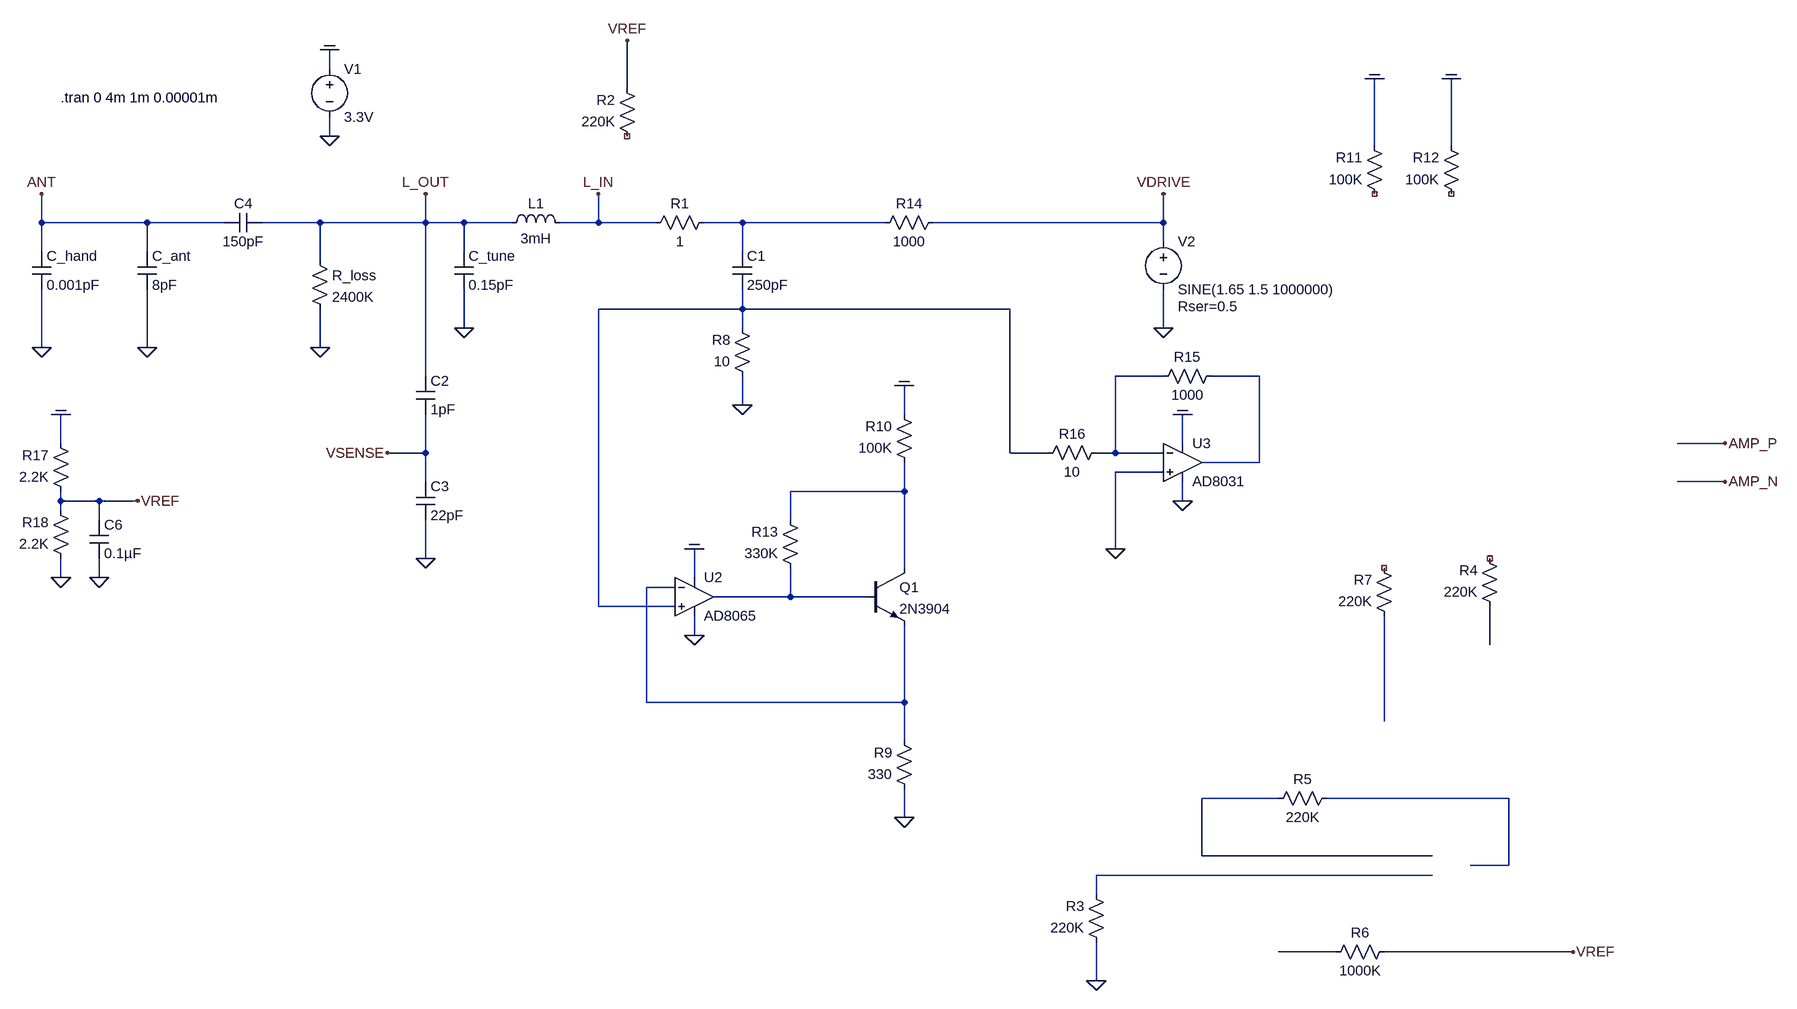
[diagram p0: schematic 2020_oscillator_experiments_v4.asc]
2020_oscillator_experiments_v4.asc, the LTspice schematic file:
Version 4
SHEET 1 3244 1620
WIRE 0 80 0 48
WIRE 496 112 496 32
WIRE 0 192 0 160
WIRE 1792 208 1792 96
WIRE 1920 208 1920 96
WIRE -480 336 -480 288
WIRE -304 336 -480 336
WIRE -176 336 -304 336
WIRE -16 336 -112 336
WIRE 160 336 160 288
WIRE 160 336 -16 336
WIRE 224 336 160 336
WIRE 304 336 224 336
WIRE 448 336 448 288
WIRE 448 336 384 336
WIRE 544 336 448 336
WIRE 688 336 624 336
WIRE 976 336 688 336
WIRE 1440 336 1440 288
WIRE 1440 336 1056 336
WIRE 1440 368 1440 336
WIRE -480 384 -480 336
WIRE -304 384 -304 336
WIRE 224 384 224 336
WIRE 688 384 688 336
WIRE -16 400 -16 336
WIRE 688 480 688 448
WIRE 688 480 448 480
WIRE 1184 480 688 480
WIRE 224 512 224 448
WIRE 688 512 688 480
WIRE 1440 512 1440 448
WIRE -480 544 -480 448
WIRE -304 544 -304 448
WIRE -16 544 -16 480
WIRE 160 592 160 336
WIRE 1440 592 1360 592
WIRE 1600 592 1520 592
WIRE 688 640 688 592
WIRE 1008 656 1008 608
WIRE -448 704 -448 656
WIRE 1472 704 1472 656
WIRE 2688 704 2608 704
WIRE 160 720 160 656
WIRE 160 720 96 720
WIRE 1184 720 1184 480
WIRE 1248 720 1184 720
WIRE 1360 720 1360 592
WIRE 1360 720 1328 720
WIRE 1440 720 1360 720
WIRE 1600 736 1600 592
WIRE 1600 736 1504 736
WIRE 1440 752 1360 752
WIRE 160 768 160 720
WIRE 2688 768 2608 768
WIRE 1008 784 1008 736
WIRE 1008 784 768 784
WIRE -448 800 -448 784
WIRE -384 800 -448 800
WIRE -320 800 -384 800
WIRE 1472 800 1472 768
WIRE -448 816 -448 800
WIRE -384 832 -384 800
WIRE 768 832 768 784
WIRE 1360 880 1360 752
WIRE 160 896 160 832
WIRE 1008 912 1008 784
WIRE -448 928 -448 896
WIRE -384 928 -384 896
WIRE 608 928 608 880
WIRE 576 944 528 944
WIRE 768 960 768 912
WIRE 768 960 640 960
WIRE 944 960 768 960
WIRE 448 976 448 480
WIRE 576 976 448 976
WIRE 608 1024 608 992
WIRE 1984 1040 1984 976
WIRE 528 1136 528 944
WIRE 1008 1136 1008 1008
WIRE 1008 1136 528 1136
WIRE 1808 1168 1808 992
WIRE 1008 1200 1008 1136
WIRE 1632 1296 1504 1296
WIRE 2016 1296 1712 1296
WIRE 1008 1328 1008 1280
WIRE 1504 1392 1504 1296
WIRE 1888 1392 1504 1392
WIRE 2016 1408 2016 1296
WIRE 2016 1408 1952 1408
WIRE 1888 1424 1328 1424
WIRE 1328 1456 1328 1424
WIRE 1728 1552 1632 1552
WIRE 2176 1552 1808 1552
WIRE 1328 1600 1328 1536
FLAG 0 192 0
FLAG 0 48 COM
FLAG -480 288 ANT
FLAG -480 544 0
FLAG -304 544 0
FLAG 688 640 0
FLAG 160 896 0
FLAG -16 544 0
FLAG 1440 512 0
FLAG 1440 288 VDRIVE
FLAG 96 720 VSENSE
FLAG 448 288 L_IN
FLAG 160 288 L_OUT
FLAG 224 512 0
FLAG 2688 704 AMP_P
FLAG 2688 768 AMP_N
FLAG 1792 96 COM
FLAG 1920 96 COM
FLAG -448 928 0
FLAG -448 656 COM
FLAG -384 928 0
FLAG -320 800 VREF
FLAG 608 880 COM
FLAG 608 1024 0
FLAG 2176 1552 VREF
FLAG 496 32 VREF
FLAG 1328 1600 0
FLAG 1008 1328 0
FLAG 1008 608 COM
FLAG 1472 656 COM
FLAG 1472 800 0
FLAG 1360 880 0
SYMBOL voltage 0 64 R0
WINDOW 123 0 0 Left 0
WINDOW 39 0 0 Left 0
SYMATTR InstName V1
SYMATTR Value 3.3V
SYMBOL ind 288 352 R270
WINDOW 0 32 56 VTop 2
WINDOW 3 5 56 VBottom 2
SYMATTR InstName L1
SYMATTR Value 3mH
SYMATTR SpiceLine Rser=120 Rpar=20Meg
SYMBOL cap 672 384 R0
SYMATTR InstName C1
SYMATTR Value 250pF
SYMBOL cap 144 592 R0
SYMATTR InstName C2
SYMATTR Value 1pF
SYMBOL cap 144 768 R0
SYMATTR InstName C3
SYMATTR Value 22pF
SYMBOL cap -320 384 R0
SYMATTR InstName C_ant
SYMATTR Value 8pF
SYMBOL cap -496 384 R0
SYMATTR InstName C_hand
SYMATTR Value 0.001pF
SYMBOL cap -112 320 R90
WINDOW 0 0 32 VBottom 2
WINDOW 3 32 32 VTop 2
SYMATTR InstName C4
SYMATTR Value 150pF
SYMBOL res -32 384 R0
SYMATTR InstName R_loss
SYMATTR Value 2400K
SYMBOL voltage 1440 352 R0
WINDOW 123 0 0 Left 0
WINDOW 39 24 124 Left 2
SYMATTR SpiceLine Rser=0.5
SYMATTR InstName V2
SYMATTR Value SINE(1.65 1.5 1000000)
SYMBOL res 640 320 R90
WINDOW 0 0 56 VBottom 2
WINDOW 3 32 56 VTop 2
SYMATTR InstName R1
SYMATTR Value 1
SYMBOL res 512 208 R180
WINDOW 0 36 76 Left 2
WINDOW 3 36 40 Left 2
SYMATTR InstName R2
SYMATTR Value 220K
SYMBOL res 1344 1552 R180
WINDOW 0 36 76 Left 2
WINDOW 3 36 40 Left 2
SYMATTR InstName R3
SYMATTR Value 220K
SYMBOL cap 208 384 R0
SYMATTR InstName C_tune
SYMATTR Value 0.15pF
SYMBOL res 1808 304 R180
WINDOW 0 36 76 Left 2
WINDOW 3 36 40 Left 2
SYMATTR InstName R11
SYMATTR Value 100K
SYMBOL res 1936 304 R180
WINDOW 0 36 76 Left 2
WINDOW 3 36 40 Left 2
SYMATTR InstName R12
SYMATTR Value 100K
SYMBOL res -432 800 R180
WINDOW 0 36 76 Left 2
WINDOW 3 36 40 Left 2
SYMATTR InstName R17
SYMATTR Value 2.2K
SYMBOL res -432 912 R180
WINDOW 0 36 76 Left 2
WINDOW 3 36 40 Left 2
SYMATTR InstName R18
SYMATTR Value 2.2K
SYMBOL cap -400 832 R0
SYMATTR InstName C6
SYMATTR Value 0.1µF
SYMBOL res 1712 1568 R270
WINDOW 0 32 56 VTop 2
WINDOW 3 0 56 VBottom 2
SYMATTR InstName R6
SYMATTR Value 1000K
SYMBOL Opamps\\AD8065 608 896 R0
SYMATTR InstName U2
SYMBOL res 2000 992 R180
WINDOW 0 36 76 Left 2
WINDOW 3 36 40 Left 2
SYMATTR InstName R4
SYMATTR Value 220K
SYMBOL res 1616 1312 R270
WINDOW 0 32 56 VTop 2
WINDOW 3 0 56 VBottom 2
SYMATTR InstName R5
SYMATTR Value 220K
SYMBOL res 1824 1008 R180
WINDOW 0 36 76 Left 2
WINDOW 3 36 40 Left 2
SYMATTR InstName R7
SYMATTR Value 220K
SYMBOL res 704 608 R180
WINDOW 0 36 76 Left 2
WINDOW 3 36 40 Left 2
SYMATTR InstName R8
SYMATTR Value 10
SYMBOL res 1024 1296 R180
WINDOW 0 36 76 Left 2
WINDOW 3 36 40 Left 2
SYMATTR InstName R9
SYMATTR Value 330
SYMBOL npn 944 912 R0
SYMATTR InstName Q1
SYMATTR Value 2N3904
SYMBOL res 1024 752 R180
WINDOW 0 36 76 Left 2
WINDOW 3 36 40 Left 2
SYMATTR InstName R10
SYMATTR Value 100K
SYMBOL res 784 928 R180
WINDOW 0 36 76 Left 2
WINDOW 3 36 40 Left 2
SYMATTR InstName R13
SYMATTR Value 330K
SYMBOL res 1072 320 R90
WINDOW 0 0 56 VBottom 2
WINDOW 3 32 56 VTop 2
SYMATTR InstName R14
SYMATTR Value 1000
SYMBOL res 1424 608 R270
WINDOW 0 32 56 VTop 2
WINDOW 3 0 56 VBottom 2
SYMATTR InstName R15
SYMATTR Value 1000
SYMBOL res 1232 736 R270
WINDOW 0 32 56 VTop 2
WINDOW 3 0 56 VBottom 2
SYMATTR InstName R16
SYMATTR Value 10
SYMBOL Opamps\\AD8031 1472 672 R0
SYMATTR InstName U3
TEXT -448 128 Left 2 !.tran 0 4m 1m 0.00001m

The netlist it stands for:
* 2020_oscillator_experiments_v4.asc
V1 COM 0 3.3V
L1 L_OUT L_IN 3mH Rser=120 Rpar=20Meg
C1 N001 N002 250pF
C2 L_OUT VSENSE 1pF
C3 VSENSE 0 22pF
C_ant ANT 0 8pF
C_hand ANT 0 0.001pF
C4 L_OUT ANT 150pF
R_loss L_OUT 0 2400K
V2 VDRIVE 0 SINE(1.65 1.5 1000000) Rser=0.5
R1 N001 L_IN 1
R2 NC_01 VREF 220K
R3 0 N012 220K
C_tune L_OUT 0 0.15pF
R11 NC_02 COM 100K
R12 NC_03 COM 100K
R17 VREF COM 2.2K
R18 0 VREF 2.2K
C6 VREF 0 0.1µF
R6 N013 VREF 1000K
XU2 N002 N006 COM 0 N007 AD8065  ; pins In+ In- V+ V- OUT
R4 N008 NC_04 220K
R5 N010 N011 220K
R7 N009 NC_05 220K
R8 0 N002 10
R9 0 N006 330
Q1 N005 N007 N006 0 2N3904
R10 N005 COM 100K
R13 N007 N005 330K
R14 VDRIVE N001 1000
R15 N003 N004 1000
R16 N002 N003 10
XU3 0 N003 COM 0 N004 AD8031  ; pins In+ In- V+ V- OUT
.model NPN NPN
.model PNP PNP
.lib standard.bjt
.tran 0 4m 1m 0.00001m
.backanno
.end